# EAGLE design breve_E73-2G4M04S (EAGLE 9.1.1)
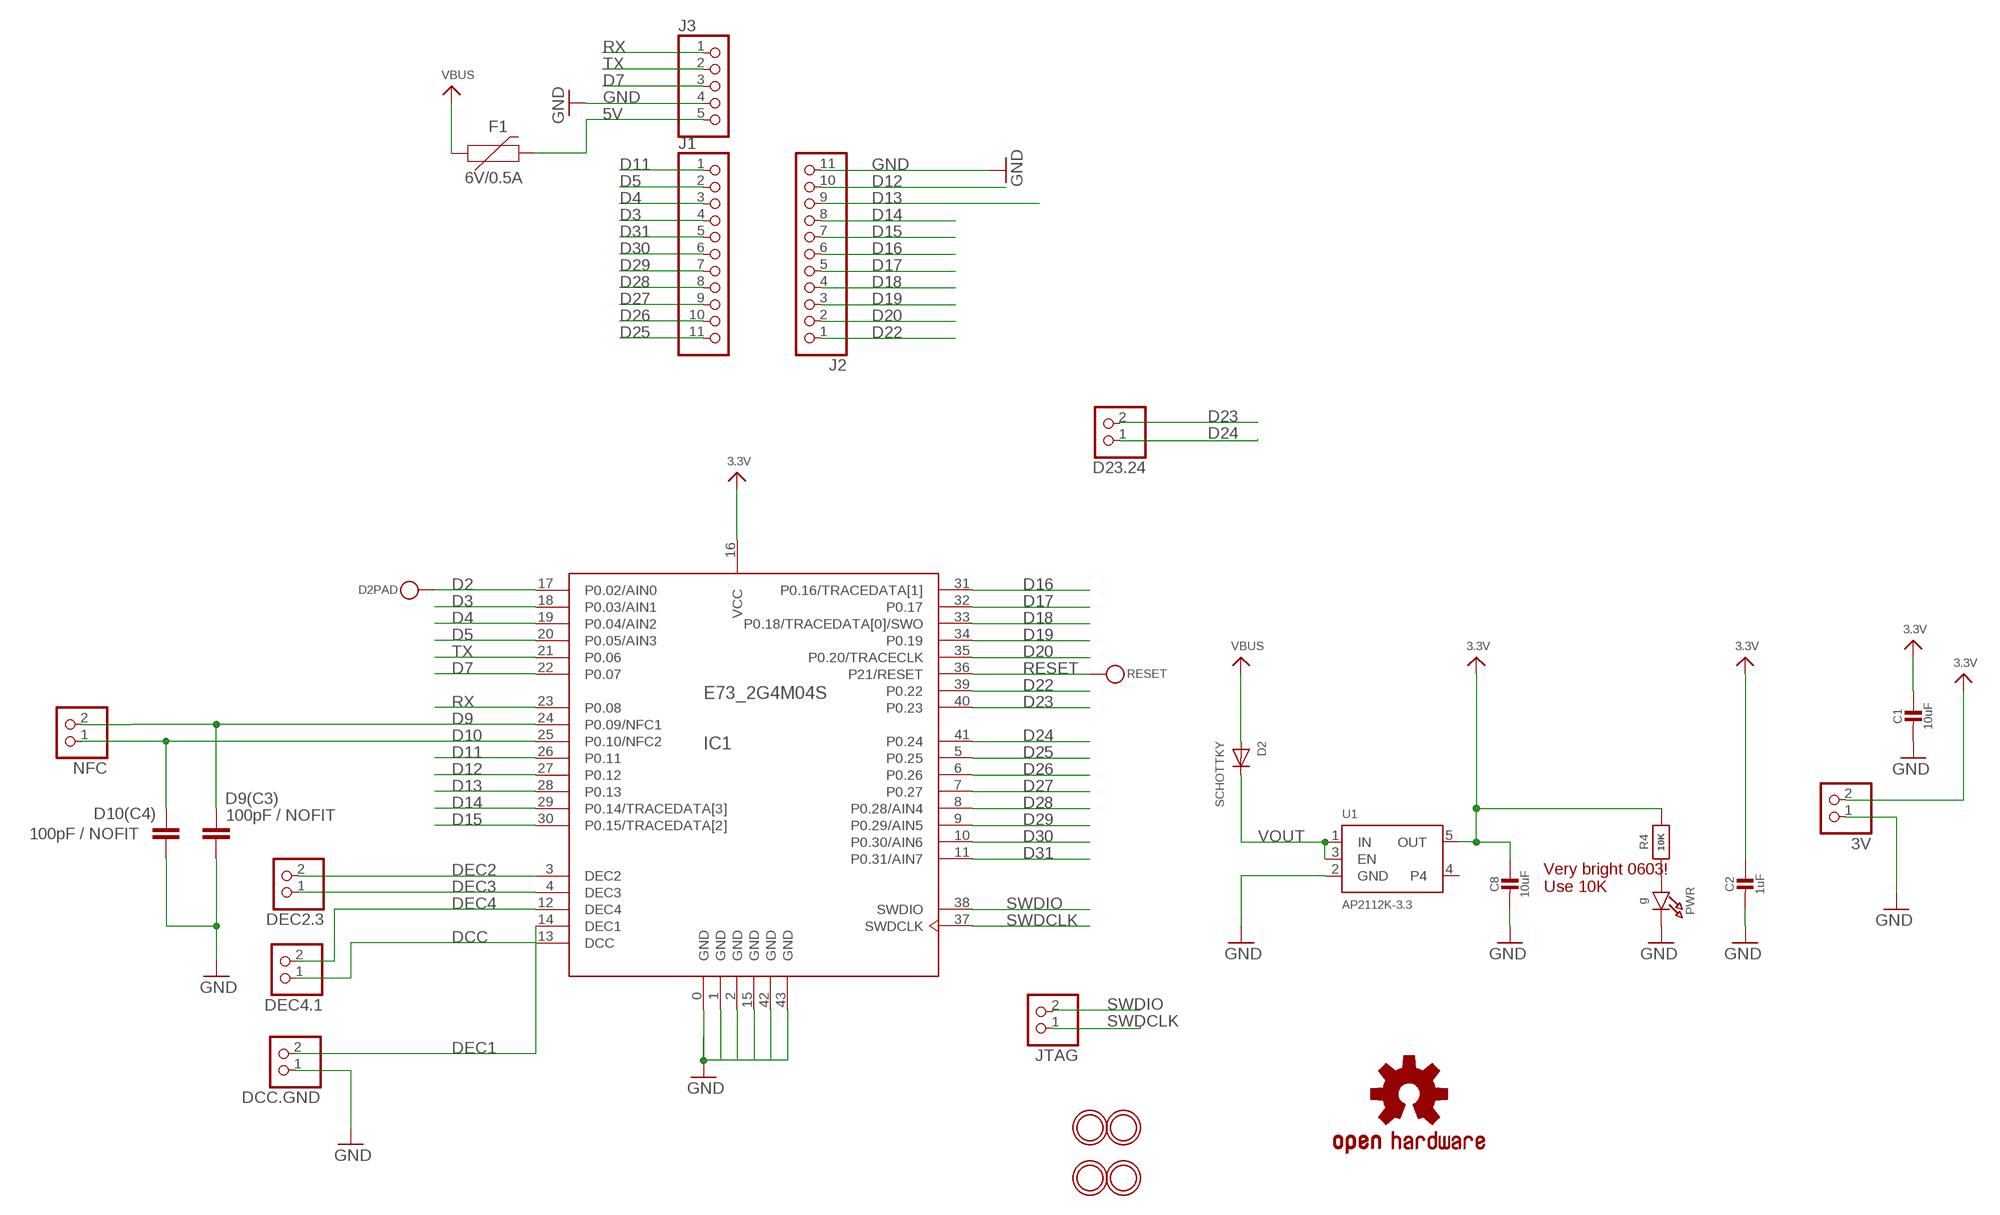
[diagram p0: schematic, sheet 1]

## Parts
3V  HEADER-1X2ROUND  [1X02_ROUND]
C1  10uF  CAP_CERAMIC0805-NOOUTLINE  [0805-NO]
C2  1uF  CAP_CERAMIC0603_NO  [0603-NO]
C8  10uF  CAP_CERAMIC0805-NOOUTLINE  [0805-NO]
D2  SCHOTTKY  DIODE_SOD-123FL  [SOD-123FL]
D2PAD  TESTPOINTROUND1.5MM  [TESTPOINT_ROUND_1.5MM]
D9(C3)  100pF / NOFIT  C-EUC0603  [C0603]
D10(C4)  100pF / NOFIT  C-EUC0603  [C0603]
D23.24  HEADER-1X2ROUND  [1X02_ROUND]
DCC.GND  HEADER-1X2ROUND  [1X02_ROUND]
DEC2.3  HEADER-1X2ROUND  [1X02_ROUND]
DEC4.1  HEADER-1X2ROUND  [1X02_ROUND]
F1  6V/0.5A  PPTC_HALF-AMP  [1206]
IC1  E73_2G4M04S  [E73_2G4M04S]
J1  PINHD-1X11_2.54-SX  [1X11-SX]
J2  PINHD-1X11_2.54-SX  [1X11-SX]
J3  PINHD-1X05_2.54-SX  [1X05-SX]
JTAG  HEADER-1X2ROUND  [1X02_ROUND]
LOGO4  OSHW-LOGOS  [OSHW-LOGO-S]
NFC  HEADER-1X2ROUND  [1X02_ROUND]
PWR  g  LED0603_NOOUTLINE  [CHIPLED_0603_NOOUTLINE]
R4  10K  RESISTOR_0603_NOOUT  [0603-NO]
RESET  TESTPOINTROUND1.5MM  [TESTPOINT_ROUND_1.5MM]
U1  AP2112K-3.3  VREG_SOT23-5  [SOT23-5]
U$2  MOUNTINGHOLE2.5  [MOUNTINGHOLE_2.5_PLATED]
U$6  MOUNTINGHOLE2.5  [MOUNTINGHOLE_2.5_PLATED]
U$31  MOUNTINGHOLE2.5  [MOUNTINGHOLE_2.5_PLATED]
U$32  MOUNTINGHOLE2.5  [MOUNTINGHOLE_2.5_PLATED]

## Nets
3.3V: 3V.2 C1.1 C2.1 C8.1 IC1.16(VCC) R4.2 U1.5(OUT)
5V: F1.2 J3.5
D2: D2PAD.P$1 IC1.17(P0.02/AIN0)
D3: IC1.18(P0.03/AIN1) J1.4
D4: IC1.19(P0.04/AIN2) J1.3
D5: IC1.20(P0.05/AIN3) J1.2
D7: IC1.22(P0.07) J3.3
D9: D9(C3).2 IC1.24(P0.09/NFC1) NFC.2
D10: D10(C4).2 IC1.25(P0.10/NFC2) NFC.1
D11: IC1.26(P0.11) J1.1
D12: IC1.27(P0.12) J2.10
D13: IC1.28(P0.13) J2.9
D14: IC1.29(P0.14/TRACEDATA[3]) J2.8
D15: IC1.30(P0.15/TRACEDATA[2]) J2.7
D16: IC1.31(P0.16/TRACEDATA[1]) J2.6
D17: IC1.32(P0.17) J2.5
D18: IC1.33(P0.18/TRACEDATA[0]/SWO) J2.4
D19: IC1.34(P0.19) J2.3
D20: IC1.35(P0.20/TRACECLK) J2.2
D22: IC1.39(P0.22) J2.1
D23: D23.24.2 IC1.40(P0.23)
D24: D23.24.1 IC1.41(P0.24)
D25: IC1.5(P0.25) J1.11
D26: IC1.6(P0.26) J1.10
D27: IC1.7(P0.27) J1.9
D28: IC1.8(P0.28/AIN4) J1.8
D29: IC1.9(P0.29/AIN5) J1.7
D30: IC1.10(P0.30/AIN6) J1.6
D31: IC1.11(P0.31/AIN7) J1.5
DCC: DEC4.1.1 IC1.13(DCC)
DEC1: DCC.GND.2 IC1.14(DEC1)
DEC2: DEC2.3.2 IC1.3(DEC2)
DEC3: DEC2.3.1 IC1.4(DEC3)
DEC4: DEC4.1.2 IC1.12(DEC4)
GND: 3V.1 C1.2 C2.2 C8.2 D9(C3).1 D10(C4).1 DCC.GND.1 IC1.0(GND) IC1.1(GND) IC1.2(GND) IC1.15(GND) IC1.42(GND) IC1.43(GND) J2.11 J3.4 PWR.C U1.2(GND)
N$6: PWR.A R4.1
RESET: IC1.36(P21/RESET) RESET.P$1
RX: IC1.23(P0.08) J3.1
SWDCLK: IC1.37(SWDCLK) JTAG.1
SWDIO: IC1.38(SWDIO) JTAG.2
TX: IC1.21(P0.06) J3.2
VBUS: D2.A F1.1
VOUT: D2.C U1.1(IN) U1.3(EN)
Unconnected: U1.4

## Notes on the sheet
- Very bright 0603!
  Use 10K

## Library data of the parts
3V D23.24 DCC.GND DEC2.3 DEC4.1 JTAG NFC = microbuilder:HEADER-1X2: PIN HEADER
C1 C2 C8 = microbuilder:CAP_CERAMIC: Ceramic Capacitors For new designs, use the packages preceded by an '_' character since they are more reliable: The following footprints should be used on most boards: _0402 - Standard footprint for regular board layouts _0603 - Standard footprint for regular board layouts _0805 - Standard footprint for regular board layouts _1206 - Standard footprint for regular board layouts For extremely tight-pitch boards where space is at a premium, the following 'micro-pitch' footprints can be used (smaller pads, no silkscreen outline, etc.): _0402MP - Micro-pitch footprint for very dense/compact boards _0603MP - Micro-pitch footprint for very dense/compact boards _0805MP - Micro-pitch footprint for very dense/compact boards _1206MP - Micro-pitch footprint for very dense/compact boards
D2 = adafruit:DIODE: Diode SMADIODE - SMA Surface Mount Package 20V 1A Schottky Diode Digikey: 641-1014-6-ND DO-1N4148 - Through Hole Small Current Diode SOD-123 20V 1 A (.5mV Vf) Schottky Diode - Digikey: MBRX120TPMSCT-ND SOD-323 10V 570mA (.38mV Vf, 3ns) Schottky Diode - Digikey: ZLLS410CT-ND SOD-523 30V 30mA Schottky Diode (RB751S-40TE61) - Digikey: RB751S-40TE61CT-ND SOT23-R/W - SOT23 Package (R = Solder Paste/Reflow Ovens, W = Hand-Soldering) BAT54Film 40V 300mA - Digikey: 497-7162-1-ND
D2PAD RESET = microbuilder:TESTPOINT: Test Point Various test points for characterisation and PCB testing TESTPOINT_SMT - Compact Surface Mount Test Point [Digikey: 5016KTR-ND]
D9(C3) D10(C4) = rcl:C-EU: CAPACITOR, European symbol
F1 = SparkFun-Fuses:PPTC: Resettable Fuse PPTC Resettable Fuse. Really a sort of resistor with a polymeric positive temperature coefficient whose resistance increases dramatically with an increase in temperature. When heated by the power passing through the resistance rises causing the current to be limited, protecting the circuit. This is achieved by the transition of the polymer from a crystalline to an amorphous state where the conductive carbon separates breaking the conductive pathways found in the cool crystalline structure. When a PPTC cools back down it resumes conducting letting the circuit turn back on. SparkFun Products: SparkFun RedBoard - Programmed with Arduino <https://www.sparkfun.com/products/12757> Pro Micro - 5V/16MHz <https://www.sparkfun.com/products/12640> Arduino Pro 328 - 5V/16MHz <https://www.sparkfun.com/products/10915> MP3 Trigger <https://www.sparkfun.com/products/13720>; PROD_ID: RES-08585
IC1 = E73-2G4M04S:E73_2G4M04S: E73-2G4M04S nRF52832 based BLE module
J1 J2 = pinhead-2:PINHD-1X11: PIN HEADER
J3 = pinhead-2:PINHD-1X05: PIN HEADER
LOGO4 = SparkFun-Aesthetics:OSHW-LOGO: Open-Source Hardware (OSHW) Logo This logo indicates the piece of hardware it is found on incorporates a OSHW license and/or adheres to the definition of open source hardware found here: http://freedomdefined.org/OSHW
PWR = microbuilder:LED: LED 0603 - 0603 Surface Mount Package 2mA: Green LED - Low Power (3.9mcd, 2ma, 1.7Vf) - Digikey: 475-2709-2-ND Orange LED - Low Power (9.8mcd, 2ma, 1.8Vf) - Digikey: 475-1194-2-ND Red LED - Low Power (5mcd, 2ma, 1.8Vf) - Digikey: 475-1195-2-ND Yellow LED - Low Power (7mcd, 2ma, 1.8Vf) - Digikey: 475-1196-2-ND 5mA: Blue LED - Low Power (17mcd, 5ma, 2.9Vf) - Digikey: LNJ937W8CRACT-ND 0805 - 0805 Surface Mount Package 2mA: Red LED (8.8mcd, 2mA, 1.8Vf, Clear) - Low Power [Digikey: 475-2510-1-ND] Green LED (5mcd, 2mA, 1.8Vf, Clear) - Low Power [Digikey: 475-2730-1-ND] Yellow LED (11.3mcd, 2mA, 1.8Vf, Clear) - Low Power [Digikey: 475-2555-1-ND] 20mA: Red LED (104mcd, 20mA, Diffused) - LS R976 [Digikey: 475-1278-6-ND] Red LED (12mcd, 20mA, 2.0Vf, Clear) - APT2012EC [Digikey: 754-1128-1-ND] Green LED (15mcd, 20mA, 2.2Vf, Clear) - APT2012GC [Digikey: 754-1131-1-ND] Orange LED (160mcd, 20mA, 2.1Vf, Clear) - APT2012SECK [Digikey: 754-1130-1-ND] 1206 - 1206 Surface Mount Package Green LED (26mcd, 20mA, Diffused) - LG N971 [Digikey: 475-1407-6-ND] Red LED (15mcd, 20mA, Diffused) - LH N974 [Digikey: 475-1416-6-ND] Cree - Cree High-Power Surface Mount LEDs XPEBWT-L1-0000-00D50 - White 111lm 350mA 2.9Vf 6200K 110° XTEAWT-00-0000-00000LEE3 - White 114lm 350mA 2.85Vf 5000K 115° Everlight - Everlight 45-21 Series Surface Mount LEDs 45-21/QK2C-B2832AC2CB2/2T - Warm White 2000mcd 20mA 3.25Vf 3050K 120° 45-21/LK2C-B38452C4CB2/2T - Nuetral White 2000mcd 20mA 3.25Vf 4150K 120° 45-21/LK2C-B50634C6CB2/2T - Cold White 2200mcd 20mA 3.25Vf 5650K 120° PLCC2 Reverse Mount LS T77K-J1L2-1-0-2-R18-Z - Red 11.25mcd 2mA 1.8Vf 630nm 120° LO T77K-L1M2-24-Z - Orange 19.6mcd 2mA 1.8Vf 606nm 120° LY T77K-K2M1-26-Z - Yellow 15.7mcd 2mA 1.8Vf 587nm 120°
R4 = microbuilder:RESISTOR: Resistors For new designs, use the packages preceded by an '_' character since they are more reliable: The following footprints should be used on most boards: _0402 - Standard footprint for regular board layouts _0603 - Standard footprint for regular board layouts _0805 - Standard footprint for regular board layouts _1206 - Standard footprint for regular board layouts For extremely tight-pitch boards where space is at a premium, the following 'micro-pitch' footprints can be used (smaller pads, no silkscreen outline, etc.): _0402MP - Micro-pitch footprint for very dense/compact boards _0603MP - Micro-pitch footprint for very dense/compact boards _0805MP - Micro-pitch footprint for very dense/compact boards _1206MP - Micro-pitch footprint for very dense/compact boards
U1 = microbuilder:VREG_SOT23-5: SOT23-5 Fixed Voltage Regulators Part Current Out V Out V In V Dropout θJA (°C/W) TJ (°C) Digikey Part No. ADP121 150mA 3.3V 3.4-5.5V 0.09V @ 150mA -- -- ADP121-AUJZ33R7CT-ND ADP121 150mA 3.0V 3.1-5.5V 0.09V @ 150mA -- -- ADP121-AUJZ30R7CT-ND ADP122 300mA 3.3V 3.4-5.5V 0.085V @ 300mA -- -- ADP122AUJZ-3.3-R7CT-ND ADP1712 300mA 3.3V 3.5-5.5V 0.17V @ 300mA -- -- ADP1712AUJZ-3.3-R7TR-ND AP7311 (Low Cost) 150mA 3.3V 3.5-6V 0.15V @ 150mA -- -- AP7311-33WG-7DICT-ND LD39015M18R 150mA 1.8V 1.9V-5.5V 0.08V @ 100mA -- -- 497-6977-1-ND LP2985A-33DBVR 150mA 3.3V 3.3-16V 0.28V @ 150mA 206 150 296-18479-1-ND MCP1824T-3302E/OT 300mA 3.3V 3.5V-6V 0.2V @ 300mA -- -- MCP1824T-3302E/OTCT-ND MIC5205-2.5YM5 TR 150mA 2.5V 2.7-16V 0.165V @ 150mA -- -- 576-1257-2-ND MIC5205-3.0YM5 TR 150mA 3.0V 3.2V-16V 0.165V @ 150mA -- -- 576-1258-2-ND MIC5205-3.3YM5 TR 150mA 3.3V 3.5V-16V 0.165V @ 150mA -- -- 576-1259-2-ND TPS780330220 150mA 3.3V+2.2V 3.6-5.5V 250mV Max -- -- 296-23332-1-ND TDA3663/N1,135 100mA 3.3V 3.5-45V 0.18V @ 50mA -- -- 568-5343-1-ND Max operating temp can be calculated using θJA, TJ (max junction temperature), and power in watts. Set the "Maximum Ambient Temperature" until it reaches TJ ("Max Junction Temperature"), which is the absolute limit for safe use of the regulator: Heat Sink Temperature Calculator <http://www.daycounter.com/Calculators/Heat-Sink-Temperature-Calculator.phtml> For example, With 12V source into a 3.3V LP2985 and a 30mA load, we are dissipating (12V-3.3V) * 0.03A = 0.261W. With a θJA of 206 °C/W, a TJ of 150°C, and 261mW we can safely use the chip without a heat sink up to 75°C (=147.1°C Junction Temperature).
U$2 U$6 U$31 U$32 = microbuilder:MOUNTINGHOLE: Mounting Hole For #2 screws (0.086"/2.18mm width, 0.094"/2.4mm hole) use 2.5mm; BOM: EXCLUDE

## Board
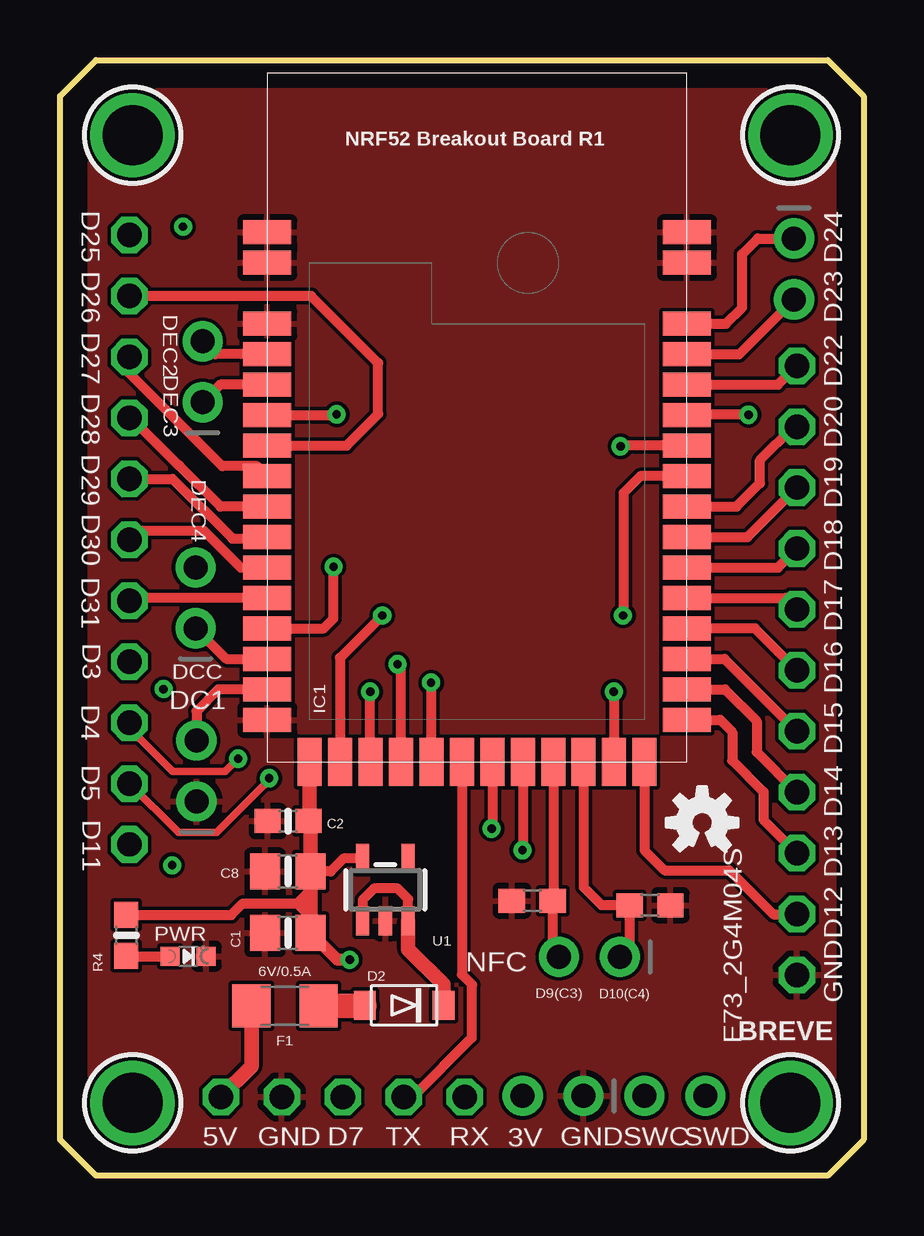
[diagram p1: board, top side]
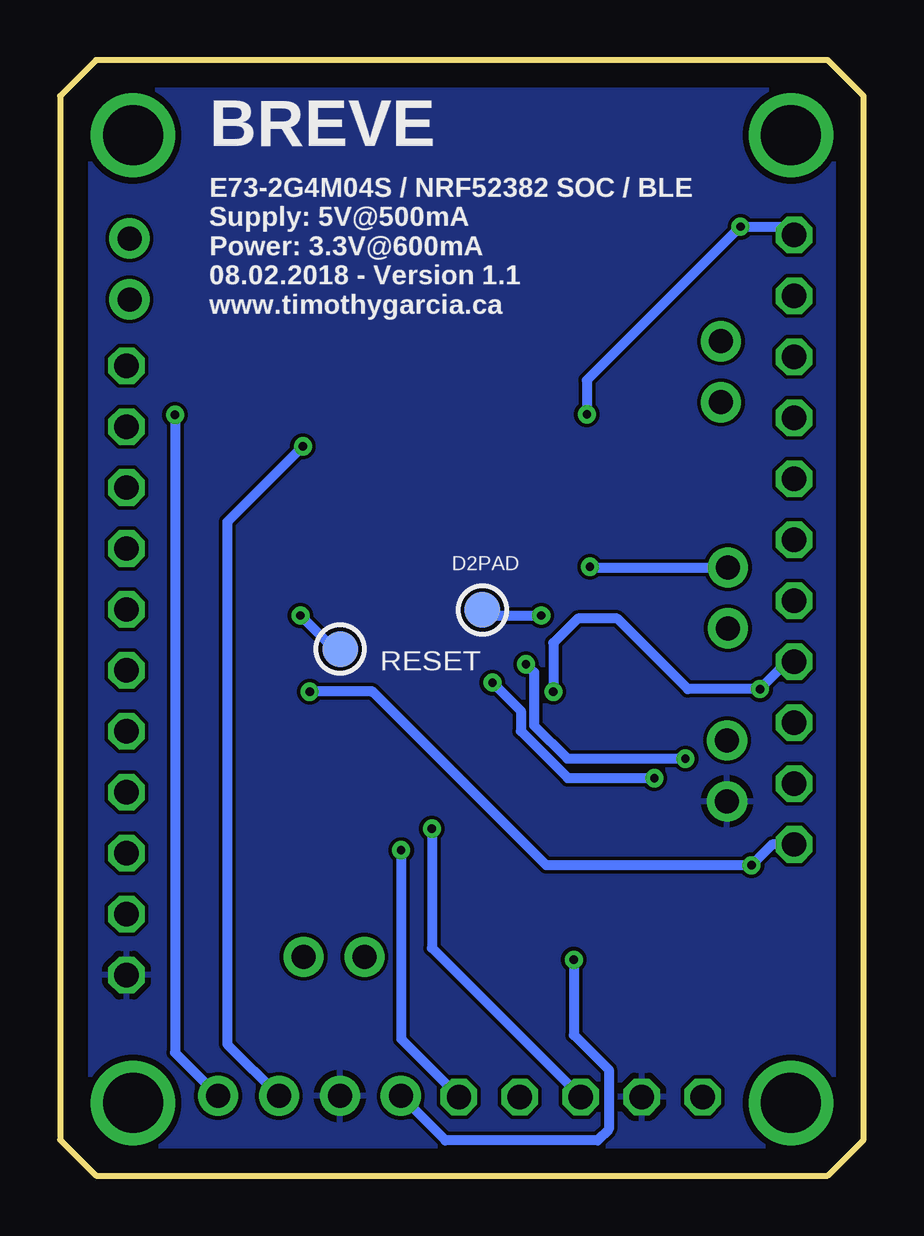
[diagram p2: board, bottom side, seen from below]

Size 33.5 x 46.5 mm. Coordinates in mm from the lower left corner, seen from the top.
Outline: 0,45 1.5,46.5 32,46.5 33.5,45 33.5,1.5 32,0 1.5,0 0,1.5 0,45
Copper layers (1*16): Top 0.035mm / dielectric 1.5mm / Bottom 0.035mm
Design rules "default": minimum track width 6mil, minimum drill 0.35mm, track to track 6mil, track to pad 6mil, pad to pad 6mil, via to via 6mil, smd to smd 6mil, copper to edge 40mil, drill to drill 6mil, minimum pad ring 10mil, minimum via ring 8mil, stop-mask expansion 4mil, vias tented up to drill 0mil, thermal gap 10mil

### Footprints (pad centres in the part's own frame; a part is rotated, then mirrored left to right if it is on the bottom)
1X02_ROUND = drill 1 pad 1.676: 1 -1.27,0; 2 1.27,0
0805-NO = smd 1.24 x 1.5: 1 -0.95,0; 2 0.95,0
0603-NO = smd 1.075 x 1: 1 -0.85,0; 2 0.85,0
SOD-123FL = smd 0.91 x 1.22: A 1.637,0; C -1.637,0
TESTPOINT_ROUND_1.5MM = smd 1.5 x 1.5: P$1 0,0
C0603 = smd 1.1 x 1: 1 -0.85,0; 2 0.85,0
1206 = smd 1.6 x 1.8: 1 -1.4,0; 2 1.4,0
E73_2G4M04S = smd 1 x 2: 0 22.065,17.5; 1 20.795,17.5; 2 18.255,17.5; 3 16.985,17.5; 4 15.715,17.5; 5 14.445,17.5; 6 13.175,17.5; 7 11.905,17.5; 8 10.635,17.5; 9 9.365,17.5; 10 8.095,17.5; 11 6.825,17.5; 12 5.555,17.5; 13 4.285,17.5; 14 3.015,17.5; 15 1.745,17.5; 28 1.745,0; 29 3.015,0; 30 4.285,0; 31 5.555,0; 32 6.825,0; 33 8.095,0; 34 9.365,0; 35 10.635,0; 36 11.905,0; 37 13.175,0; 38 14.445,0; 39 15.715,0; 40 16.985,0; 41 18.255,0; 42 20.795,0; 43 22.065,0 | smd 2 x 1: 16 0,15.735; 17 0,14.465; 18 0,13.195; 19 0,11.925; 20 0,10.655; 21 0,9.385; 22 0,8.115; 23 0,6.845; 24 0,5.575; 25 0,4.305; 26 0,3.035; 27 0,1.765
1X11-SX = drill 1.016 octagon: 1 -12.7,0; 2 -10.16,0; 3 -7.62,0; 4 -5.08,0; 5 -2.54,0; 6 0,0; 7 2.54,0; 8 5.08,0; 9 7.62,0; 10 10.16,0; 11 12.7,0
1X05-SX = drill 1.016 octagon: 1 -5.08,0; 2 -2.54,0; 3 0,0; 4 2.54,0; 5 5.08,0
CHIPLED_0603_NOOUTLINE = smd 0.8 x 0.8: A 0,-0.75; C 0,0.75
SOT23-5 = smd 0.55 x 1.2: 1 -0.95,-1.3; 2 0,-1.3; 3 0.95,-1.3; 4 0.95,1.3; 5 -0.95,1.3
MOUNTINGHOLE_2.5_PLATED = drill 2.5 pad 3.2: P$1 0,0

### Placement (x,y rotation side)
3V  20.56,3.32 180 top
C1  9.5,10.11 180 top
C2  9.51,14.77 180 top
C8  9.5,12.68 180 top
D2  14.35,7.1 180 top
D2PAD  15.89,23.58 0 bottom
D9(C3)  19.69,11.45 0 top
D10(C4)  24.6,11.27 180 top
D23.24  30.6,37.79 270 top
DCC.GND  5.69,16.87 90 top
DEC2.3  5.95,33.5 90 top
DEC4.1  5.66,24.08 90 top
F1  9.38,7.08 180 top
IC1  26.14,17.25 90 top
J1  2.89,26.5 90 top
J2  30.72,21.06 270 top
J3  11.79,3.28 180 top
JTAG  25.64,3.32 0 top
LOGO4  26.77,14.71 0 top
NFC  22.07,9.12 180 top
PWR  5.35,9.14 270 top
R4  2.77,10.01 90 top
RESET  21.82,21.95 0 bottom
U1  13.56,11.91 0 top
U$2  3.02,43.36 0 top
U$6  30.46,43.36 0 top
U$31  3.02,3.02 0 top
U$32  30.46,3.02 0 top

### Tracks (layer width: path | path; a pad name or v marks a point on that pad's centre or on a via)
3.3V  (via drill 0.35)
  Top 0.406: U1.5 11.82,13.21 11.28,12.68 C8.1 | R4.2 7.14,10.86 7.62,11.33 9.88,11.33 | 9.88,11.33 10.19,11.33 10.45,11.59 | 9.88,11.33 10.45,11.9 10.45,12.04 | 9.88,11.33 10.44,10.77 10.45,10.77
  Top 0.508: v12.08,9 11.57,9 C1.1
  Top 0.61: IC1.16 10.4,14.81 | 10.4,14.81 C2.1 | 10.4,14.81 10.45,14.77 C8.1 10.45,12.04 10.45,11.59 10.45,10.77 C1.1
  Bottom 0.406: v12.08,9 12.08,5.86 10.62,4.41 10.62,1.93 11.09,1.46 17.43,1.46 3V.2
5V
  Top 0.61: F1.2 7.98,4.55 J3.5
D2  (via drill 0.35)
  Top 0.406: v13.44,23.34 11.67,21.58 IC1.17
  Bottom 0.406: D2PAD.P$1 15.66,23.34 v13.44,23.34
D3  (via drill 0.35)
  Top 0.406: IC1.18 v12.93,20.17
  Bottom 0.406: J1.4 3.17,21.42 v4.32,20.28 7.32,20.28 10.26,23.22 11.91,23.22 12.93,22.2 v12.93,20.17
D4  (via drill 0.35)
  Top 0.305: v7.42,17.38 6.89,16.84 4.7,16.84 2.89,18.65 J1.3
  Top 0.406: IC1.19 14.21,21.17 v14.07,21.31
  Bottom 0.406: v14.07,21.31 13.73,20.97 13.73,18.76 12.35,17.38 v7.42,17.38
D5  (via drill 0.35)
  Top 0.305: J1.2 4.94,14.29 6.53,14.29 8.72,16.48 v8.72,16.56
  Top 0.406: v15.47,20.55 IC1.20
  Bottom 0.406: v15.47,20.55 14.29,19.37 14.29,18.53 12.33,16.56 v8.72,16.56
D7  (via drill 0.35)
  Top 0.406: IC1.22 18.02,14.49 v17.99,14.46
  Bottom 0.406: v17.99,14.46 17.99,9.48 J3.3
D9
  Top 0.406: IC1.24 20.56,11.48 D9(C3).2 20.54,9.38 NFC.2
D10
  Top 0.406: IC1.25 21.83,12.03 22.58,11.28 D10(C4).2 23.75,9.52 NFC.1
D11  (via drill 0.35)
  Top 0.406: v23.09,20.17 23.1,20.16 IC1.26
  Bottom 0.406: J1.1 3.8,13.8 v4.67,12.93 13.22,12.93 20.49,20.2 20.52,20.17 v23.09,20.17
D12
  Top 0.406: IC1.27 24.37,13.55 25.2,12.72 27.9,12.72 29.73,10.9 J2.10
D13
  Top 0.406: IC1.28 27.52,18.99 28.03,18.49 28.03,17.29 29.33,15.99 29.33,14.83 J2.9
D14
  Top 0.406: IC1.29 27.73,20.26 29.05,18.95 29.05,17.65 J2.8
D15
  Top 0.406: IC1.30 27.7,21.53 J2.7
D16
  Top 0.406: J2.6 28.98,22.8 IC1.31
D17
  Top 0.406: IC1.32 30.25,24.07 J2.5
D18
  Top 0.406: IC1.33 29.93,25.34 J2.4
D19
  Top 0.406: IC1.34 28.66,26.61 J2.3
D20
  Top 0.406: IC1.35 28.21,27.88 29.19,28.86 29.19,29.81 30.59,31.22 J2.2
D22
  Top 0.406: IC1.39 29.93,32.96 J2.1
D23
  Top 0.406: IC1.40 28.32,34.23 D23.24.2
D24
  Top 0.406: 27.05,35.5 IC1.41 27.77,35.5 28.45,36.18 28.45,38.41 29.09,39.06 D23.24.1
D25  (via drill 0.35)
  Top 0.406: IC1.5 11.5,31.69 v11.53,31.73
  Bottom 0.406: v11.53,31.73 11.53,33.15 v5.13,39.55 3.24,39.55 J1.11
D26
  Top 0.406: IC1.6 11.95,30.42 13.27,31.74 13.27,33.87 10.47,36.67 J1.10
D27
  Top 0.406: IC1.7 8.22,29.57 6.76,29.57 2.89,33.44 J1.9
D28
  Top 0.406: IC1.8 6.7,27.88 4.98,29.6 4.95,29.6 2.97,31.58 J1.8
D29
  Top 0.406: J1.7 4.69,29.04 7.19,26.54 8.57,26.54 IC1.9
D30
  Top 0.406: J1.6 2.89,26.66 3.11,26.88 6,26.88 7.54,25.34 IC1.10
D31
  Top 0.406: IC1.11 3,24.07 J1.5
DCC
  Top 0.406: DEC4.1.1 6.93,21.53 IC1.13
DEC1
  Top 0.406: IC1.14 6.6,20.26 5.69,19.35 DCC.GND.2
DEC2
  Top 0.406: IC1.3 6.49,34.23 DEC2.3.2
DEC3
  Top 0.406: IC1.4 6.67,32.96 DEC2.3.1
DEC4  (via drill 0.35)
  Top 0.406: IC1.12 10.99,22.8 11.41,23.22 v11.41,25.38
  Bottom 0.406: v11.41,25.38 11.38,25.35 DEC4.1.2
GND
  pour Top: 0,45 1.5,46.5 32,46.5 33.5,45 33.5,1.5 32,0 1.5,0 0,1.5
  pour Bottom: 0,45 1.5,46.5 32,46.5 33.5,45 33.5,1.5 32,0 31.5,0 1.5,0 0,1.5
N$6
  Top 0.406: R4.1 2.79,9.14 PWR.A
RESET  (via drill 0.35)
  Top 0.406: IC1.36 24.19,29.15 23.49,28.45 23.49,23.36 v23.47,23.34
  Bottom 0.406: v23.47,23.34 22.07,21.95 RESET.P$1
RX  (via drill 0.35)
  Top 0.406: IC1.23 19.29,13.58 v19.28,13.56
  Bottom 0.406: v19.28,13.56 19.28,5.69 J3.1
SWDCLK  (via drill 0.35)
  Top 0.406: IC1.37 23.39,30.42 v23.37,30.4
  Bottom 0.406: v23.37,30.4 26.52,27.24 26.52,16.5 26.52,5.47 JTAG.1
SWDIO  (via drill 0.35)
  Top 0.406: v28.7,31.71 26.15,31.71 IC1.38
  Bottom 0.406: v28.7,31.71 28.7,5.12 JTAG.2
TX
  Top 0.406: IC1.21 16.75,8.38 17.2,7.94 17.16,7.91 17.16,5.73 14.71,3.28 J3.2
VBUS
  Top 0.61: 12.69,7.08 D2.A
  Top 1.016: F1.1 12.69,7.08
VOUT
  Top 0.406: U1.3 14.52,11.53 14.08,11.96 13.09,11.96 12.62,11.49 U1.1
  Top 0.61: D2.C 15.99,7.97 14.52,9.44 U1.3

### Text on the board
tNames: NRF52 Breakout Board R1 | D25 | D24 | D26 | D23 | D27 | DEC2 | D22 | DEC3 | D28 | D20 | D29 | D19 | DEC4 | D30 | D18 | D31 | D17 | D3 | DCC | D16 | DC1 | D4 | D15 | D5 | D14 | D11 | D13 | D12 | GND | BREVE | 5V | GND | D7 | TX | RX | GND | SWC | SWD
bNames: BREVE | E73-2G4M04S / NRF52382 SOC / BLE / Supply: 5V@500mA / Power: 3.3V@600mA / 08.02.2018 - Version 1.1 / www.timothygarcia.ca